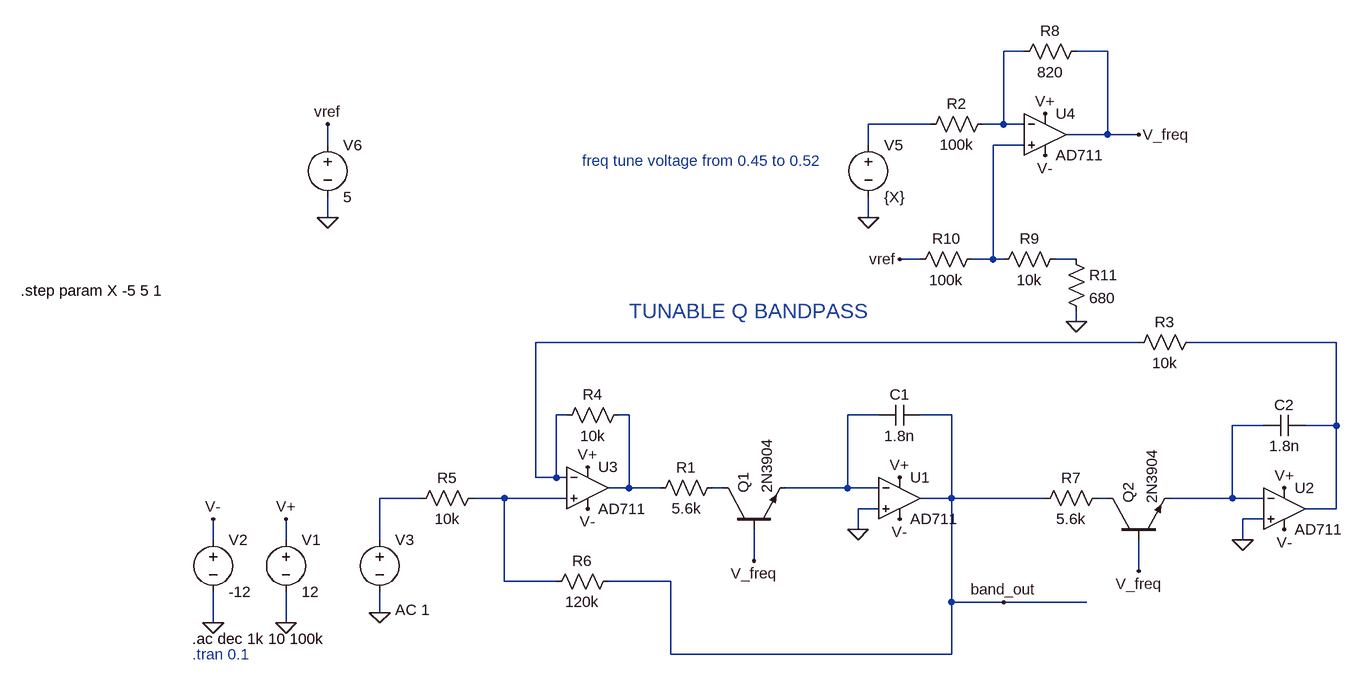
[diagram p0: schematic VC_bandpass.asc]
VC_bandpass.asc, the LTspice schematic file:
Version 4
SHEET 1 2164 680
WIRE 1248 -656 1216 -656
WIRE 1376 -656 1328 -656
WIRE 1104 -544 1008 -544
WIRE 1216 -544 1216 -656
WIRE 1216 -544 1184 -544
WIRE 1248 -544 1216 -544
WIRE 1376 -528 1376 -656
WIRE 1376 -528 1312 -528
WIRE 1424 -528 1376 -528
WIRE 176 -512 176 -544
WIRE 1008 -512 1008 -544
WIRE 1248 -512 1200 -512
WIRE 176 -400 176 -432
WIRE 1008 -400 1008 -432
WIRE 1088 -336 1056 -336
WIRE 1200 -336 1200 -512
WIRE 1200 -336 1168 -336
WIRE 1216 -336 1200 -336
WIRE 1328 -336 1296 -336
WIRE 1328 -240 1328 -256
WIRE 1424 -208 496 -208
WIRE 1728 -208 1504 -208
WIRE 544 -96 528 -96
WIRE 640 -96 624 -96
WIRE 1024 -96 976 -96
WIRE 1136 -96 1088 -96
WIRE 1616 -80 1568 -80
WIRE 1728 -80 1728 -208
WIRE 1728 -80 1680 -80
WIRE 496 0 496 -208
WIRE 528 0 528 -96
WIRE 528 0 496 0
WIRE 544 0 528 0
WIRE 640 16 640 -96
WIRE 640 16 608 16
WIRE 688 16 640 16
WIRE 784 16 768 16
WIRE 976 16 976 -96
WIRE 976 16 880 16
WIRE 1024 16 976 16
WIRE 320 32 256 32
WIRE 448 32 400 32
WIRE 544 32 448 32
WIRE 1136 32 1136 -96
WIRE 1136 32 1088 32
WIRE 1280 32 1136 32
WIRE 1376 32 1360 32
WIRE 1568 32 1568 -80
WIRE 1568 32 1472 32
WIRE 1616 32 1568 32
WIRE 1024 48 992 48
WIRE 1728 48 1728 -80
WIRE 1728 48 1680 48
WIRE 1616 64 1584 64
WIRE 992 80 992 48
WIRE 0 96 0 64
WIRE 112 96 112 64
WIRE 256 96 256 32
WIRE 1584 96 1584 64
WIRE 832 128 832 80
WIRE 1424 144 1424 96
WIRE 448 160 448 32
WIRE 528 160 448 160
WIRE 704 160 608 160
WIRE 1136 192 1136 32
WIRE 1216 192 1136 192
WIRE 1344 192 1216 192
WIRE 256 208 256 176
WIRE 0 224 0 176
WIRE 112 224 112 176
WIRE 704 272 704 160
WIRE 1136 272 1136 192
WIRE 1136 272 704 272
FLAG 112 224 0
FLAG 112 64 V+
FLAG 0 224 0
FLAG 0 64 V-
FLAG 1056 0 V+
FLAG 1056 64 V-
FLAG 992 80 0
FLAG 1648 16 V+
FLAG 1648 80 V-
FLAG 1584 96 0
FLAG 576 48 V-
FLAG 576 -16 V+
FLAG 1216 192 band_out
FLAG 256 208 0
FLAG 1424 144 V_freq
FLAG 832 128 V_freq
FLAG 1280 -560 V+
FLAG 1280 -496 V-
FLAG 1008 -400 0
FLAG 1424 -528 V_freq
FLAG 176 -400 0
FLAG 176 -544 vref
FLAG 1056 -336 vref
FLAG 1328 -240 0
SYMBOL voltage 112 80 R0
WINDOW 123 0 0 Left 0
WINDOW 39 0 0 Left 0
SYMATTR InstName V1
SYMATTR Value 12
SYMBOL voltage 0 80 R0
WINDOW 123 0 0 Left 0
WINDOW 39 0 0 Left 0
SYMATTR InstName V2
SYMATTR Value -12
SYMBOL OpAmps\\AD711 1056 -32 R0
SYMATTR InstName U1
SYMBOL cap 1088 -112 R90
WINDOW 0 0 32 VBottom 2
WINDOW 3 32 32 VTop 2
SYMATTR InstName C1
SYMATTR Value 1.8n
SYMBOL OpAmps\\AD711 1648 -16 R0
SYMATTR InstName U2
SYMBOL cap 1680 -96 R90
WINDOW 0 0 32 VBottom 2
WINDOW 3 32 32 VTop 2
SYMATTR InstName C2
SYMATTR Value 1.8n
SYMBOL OpAmps\\AD711 576 -48 R0
SYMATTR InstName U3
SYMBOL res 1520 -224 R90
WINDOW 0 0 56 VBottom 2
WINDOW 3 32 56 VTop 2
SYMATTR InstName R3
SYMATTR Value 10k
SYMBOL res 640 -112 R90
WINDOW 0 0 56 VBottom 2
WINDOW 3 32 56 VTop 2
SYMATTR InstName R4
SYMATTR Value 10k
SYMBOL res 416 16 R90
WINDOW 0 0 56 VBottom 2
WINDOW 3 32 56 VTop 2
SYMATTR InstName R5
SYMATTR Value 10k
SYMBOL res 624 144 R90
WINDOW 0 0 56 VBottom 2
WINDOW 3 32 56 VTop 2
SYMATTR InstName R6
SYMATTR Value 120k
SYMBOL voltage 256 80 R0
WINDOW 123 24 124 Left 2
WINDOW 39 0 0 Left 0
SYMATTR Value2 AC 1
SYMATTR InstName V3
SYMATTR Value ""
SYMBOL npn 1376 96 R270
SYMATTR InstName Q2
SYMATTR Value 2N3904
SYMBOL res 1264 48 R270
WINDOW 0 32 56 VTop 2
WINDOW 3 0 56 VBottom 2
SYMATTR InstName R7
SYMATTR Value 5.6k
SYMBOL npn 784 80 R270
SYMATTR InstName Q1
SYMATTR Value 2N3904
SYMBOL res 672 32 R270
WINDOW 0 32 56 VTop 2
WINDOW 3 0 56 VBottom 2
SYMATTR InstName R1
SYMATTR Value 5.6k
SYMBOL OpAmps\\AD711 1280 -592 R0
SYMATTR InstName U4
SYMBOL res 1200 -560 R90
WINDOW 0 0 56 VBottom 2
WINDOW 3 32 56 VTop 2
SYMATTR InstName R2
SYMATTR Value 100k
SYMBOL res 1344 -672 R90
WINDOW 0 0 56 VBottom 2
WINDOW 3 32 56 VTop 2
SYMATTR InstName R8
SYMATTR Value 820
SYMBOL voltage 1008 -528 R0
WINDOW 123 0 0 Left 0
WINDOW 39 0 0 Left 0
SYMATTR InstName V5
SYMATTR Value {X}
SYMBOL res 1200 -320 R270
WINDOW 0 32 56 VTop 2
WINDOW 3 0 56 VBottom 2
SYMATTR InstName R9
SYMATTR Value 10k
SYMBOL res 1072 -320 R270
WINDOW 0 32 56 VTop 2
WINDOW 3 0 56 VBottom 2
SYMATTR InstName R10
SYMATTR Value 100k
SYMBOL voltage 176 -528 R0
WINDOW 123 0 0 Left 0
WINDOW 39 0 0 Left 0
SYMATTR InstName V6
SYMATTR Value 5
SYMBOL res 1312 -352 R0
SYMATTR InstName R11
SYMATTR Value 680
TEXT -32 248 Left 2 !.ac dec 1k 10 100k
TEXT 640 -256 Left 3 ;TUNABLE Q BANDPASS
TEXT -32 272 Left 2 ;.tran 0.1
TEXT 568 -488 Left 2 ;freq tune voltage from 0.45 to 0.52
TEXT -296 -288 Left 2 !.step param X -5 5 1

The netlist it stands for:
* VC_bandpass.asc
V1 V+ 0 12
V2 V- 0 -12
XU1 0 N008 V+ V- band_out AD712  ; AD711, pins In+ In- V+ V- OUT
C1 band_out N008 1.8n
XU2 0 N009 V+ V- N006 AD712  ; AD711, pins In+ In- V+ V- OUT
C2 N006 N009 1.8n
XU3 N012 N005 V+ V- N007 AD712  ; AD711, pins In+ In- V+ V- OUT
R3 N006 N005 10k
R4 N007 N005 10k
R5 N012 N011 10k
R6 band_out N012 120k
V3 N011 0 AC 1
Q2 N013 V_freq N009 0 2N3904
R7 band_out N013 5.6k
Q1 N010 V_freq N008 0 2N3904
R1 N007 N010 5.6k
XU4 N003 N001 V+ V- V_freq AD712  ; AD711, pins In+ In- V+ V- OUT
R2 N001 N002 100k
R8 V_freq N001 820
V5 N002 0 {X}
R9 N003 N004 10k
R10 vref N003 100k
V6 vref 0 5
R11 N004 0 680
.model NPN NPN
.model PNP PNP
.lib standard.bjt
.ac dec 1k 10 100k
* TUNABLE Q BANDPASS
* .tran 0.1
* freq tune voltage from 0.45 to 0.52
.step param X -5 5 1
.lib ADI1.lib
.backanno
.end